# EAGLE design crz7shlda0 (EAGLE 9.6.2)

## Sheet 1 of 2
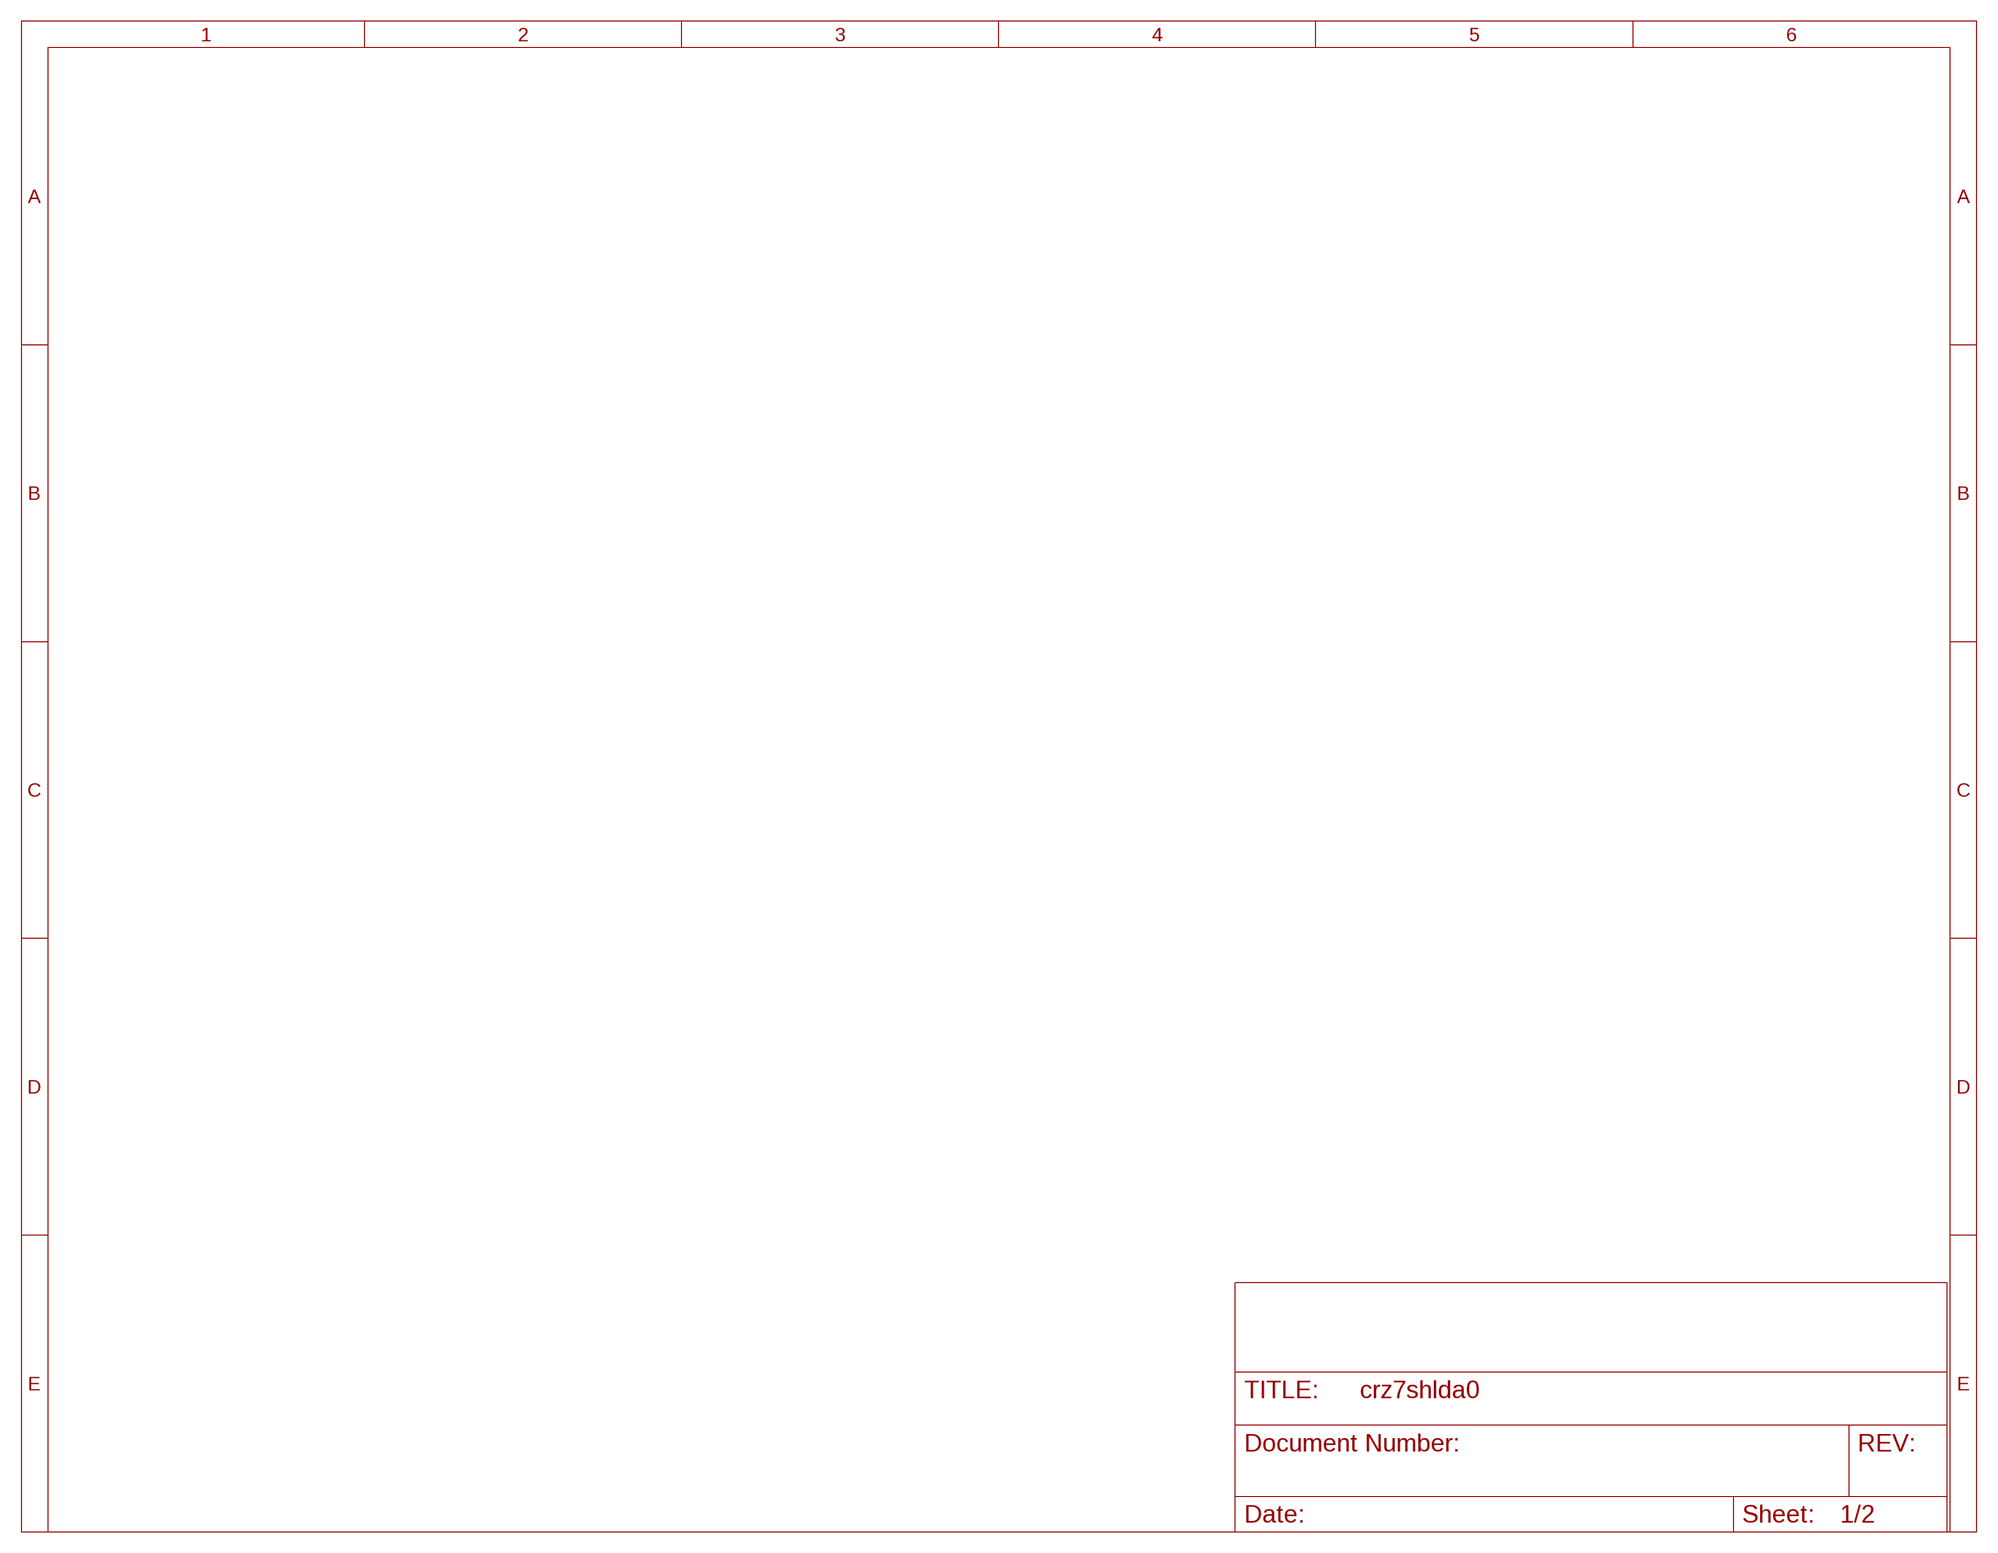
[diagram p0: schematic, sheet 1]

## Sheet 2 of 2
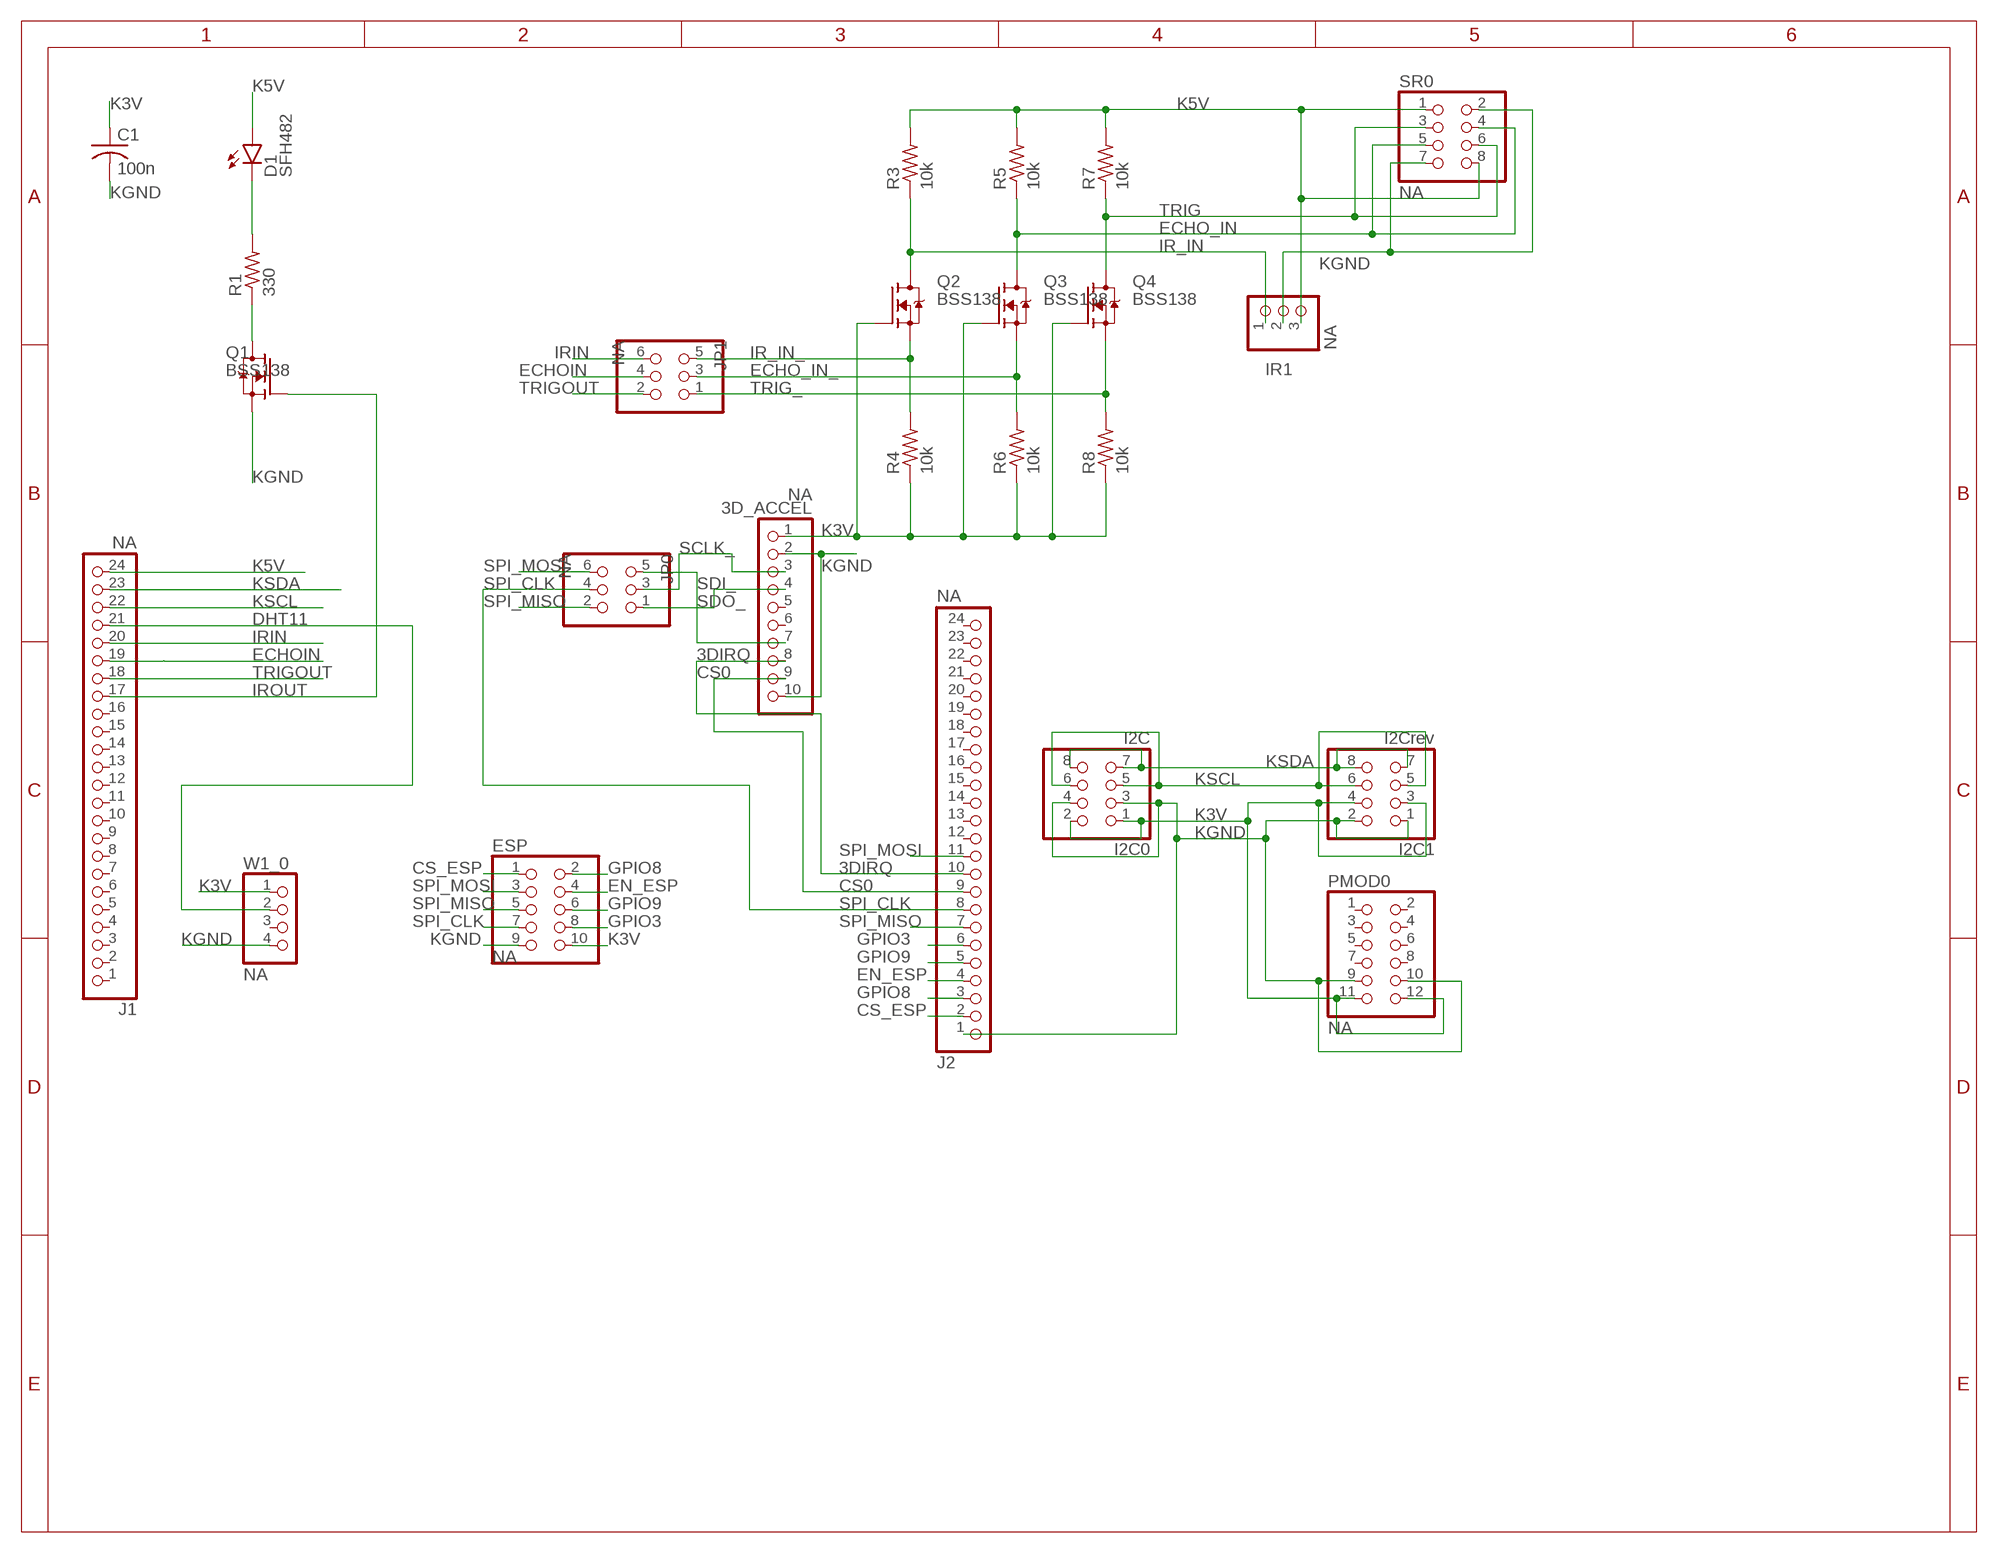
[diagram p1: schematic, sheet 2]

### Parts
3D_ACCEL  NA  PINHD-1X10  [1X10]
C1  100n  C-USC0402  [C0402]
D1  SFH482  [SFH482]
ESP  NA  PINHD-2X5  [2X05]
I2C0  I2C  PINHD-2X4  [2X04]
I2C1  I2Crev  PINHD-2X4  [2X04]
IR1  NA  PINHD-1X3  [1X03]
J1  NA  PINHD-1X24  [1X24]
J2  NA  PINHD-1X24  [1X24]
JP0  NA  PINHD-2X3  [2X03]
JP1  NA  PINHD-2X3  [2X03]
PMOD0  NA  PINHD-2X6  [2X06]
Q1  BSS138  [SOT23]
Q2  BSS138  [SOT23]
Q3  BSS138  [SOT23]
Q4  BSS138  [SOT23]
R1  330  R-US_R0402  [R0402]
R3  10k  R-US_R0402  [R0402]
R4  10k  R-US_R0402  [R0402]
R5  10k  R-US_R0402  [R0402]
R6  10k  R-US_R0402  [R0402]
R7  10k  R-US_R0402  [R0402]
R8  10k  R-US_R0402  [R0402]
SR0  NA  PINHD-2X4  [2X04]
W1_0  NA  PINHD-1X4  [1X04]

### Nets
3DIRQ: 3D_ACCEL.8 J2.10
CS0: 3D_ACCEL.9 J2.9
CS_ESP: ESP.1 J2.2
DHT11: J1.21 W1_0.2
ECHO_IN: Q3.3(D) R5.1 SR0.4 SR0.5
ECHO_IN_: JP1.3 Q3.2(S) R6.2
ECHOIN: J1.19 JP1.4
EN_ESP: ESP.4 J2.4
GPIO3: ESP.8 J2.6
GPIO8: ESP.2 J2.3
GPIO9: ESP.6 J2.5
IR_IN: IR1.1 Q2.3(D) R3.1
IR_IN_: JP1.5 Q2.2(S) R4.2
IRIN: J1.20 JP1.6
IROUT: J1.17 Q1.1(G)
K3V: 3D_ACCEL.1 C1.1 ESP.10 I2C0.1 I2C0.2 I2C1.3 I2C1.4 PMOD0.11 PMOD0.12 Q2.1(G) Q3.1(G) Q4.1(G) R4.1 R6.1 R8.1 W1_0.1
K5V: D1.A IR1.3 J1.24 R3.2 R5.2 R7.2 SR0.1 SR0.8
KGND: 3D_ACCEL.2 3D_ACCEL.10 C1.2 ESP.9 I2C0.3 I2C0.4 I2C1.1 I2C1.2 IR1.2 J2.1 PMOD0.9 PMOD0.10 Q1.2(S) SR0.2 SR0.7 W1_0.4
KSCL: I2C0.5 I2C0.6 I2C1.5 I2C1.6 J1.22
KSDA: I2C0.7 I2C0.8 I2C1.7 I2C1.8 J1.23
N$3: Q1.3(D) R1.1
N$5: D1.K(C) R1.2
SCLK_: 3D_ACCEL.3 JP0.3
SDI_: 3D_ACCEL.4 JP0.1
SDO_: 3D_ACCEL.7 JP0.5
SPI_CLK: ESP.7 J2.8 JP0.4
SPI_MISO: ESP.5 J2.7 JP0.2
SPI_MOSI: ESP.3 J2.11 JP0.6
TRIG: Q4.3(D) R7.1 SR0.3 SR0.6
TRIG_: JP1.1 Q4.2(S) R8.2
TRIGOUT: J1.18 JP1.2
Unconnected: 3D_ACCEL.5 3D_ACCEL.6 J1.1 J1.2 J1.3 J1.4 J1.5 J1.6 J1.7 J1.8 J1.9 J1.10 J1.11 J1.12 J1.13 J1.14 J1.15 J1.16 J2.12 J2.13 J2.14 J2.15 J2.16 J2.17 J2.18 J2.19 J2.20 J2.21 J2.22 J2.23 J2.24 PMOD0.1 PMOD0.2 PMOD0.3 PMOD0.4 PMOD0.5 PMOD0.6 PMOD0.7 PMOD0.8 W1_0.3

## Library data of the parts
3D_ACCEL = pinhead2:PINHD-1X10: PIN HEADER
C1 = rcl:C-US: CAPACITOR, American symbol; SPICEPREFIX: C
D1 = led:SFH482: IR LED infrared emitting diode, Infineon
ESP = pinhead:PINHD-2X5: PIN HEADER
I2C0 I2C1 SR0 = pinhead:PINHD-2X4: PIN HEADER
IR1 = pinhead2:PINHD-1X3: PIN HEADER
J1 J2 = pinhead2:PINHD-1X24: PIN HEADER
JP0 JP1 = pinhead:PINHD-2X3: PIN HEADER
PMOD0 = pinhead:PINHD-2X6: PIN HEADER
Q1-Q4 = bss138_10:BSS138: BSS138 N-Channel Logic Level Enhancement Mode Field Effect Transistor Source: http://www.fairchildsemi.com/datasheets/BS/BSS138.pdf; MF: Fairchild; MPN: BSS138; OC_FARNELL: 9845330; OC_NEWARK: 67R2009
R1 R3-R8 = rcl:R-US_: RESISTOR, American symbol; SPICEPREFIX: R
W1_0 = pinhead2:PINHD-1X4: PIN HEADER

## Board
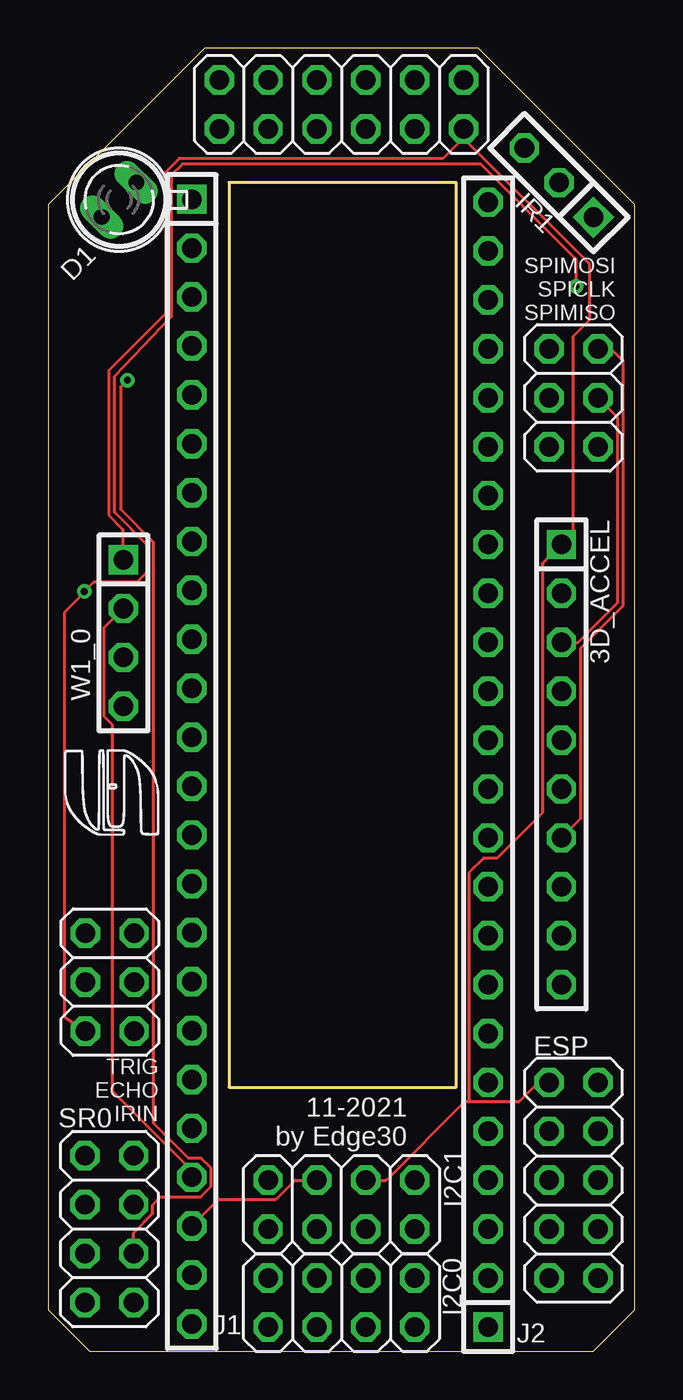
[diagram p2: board, top side]
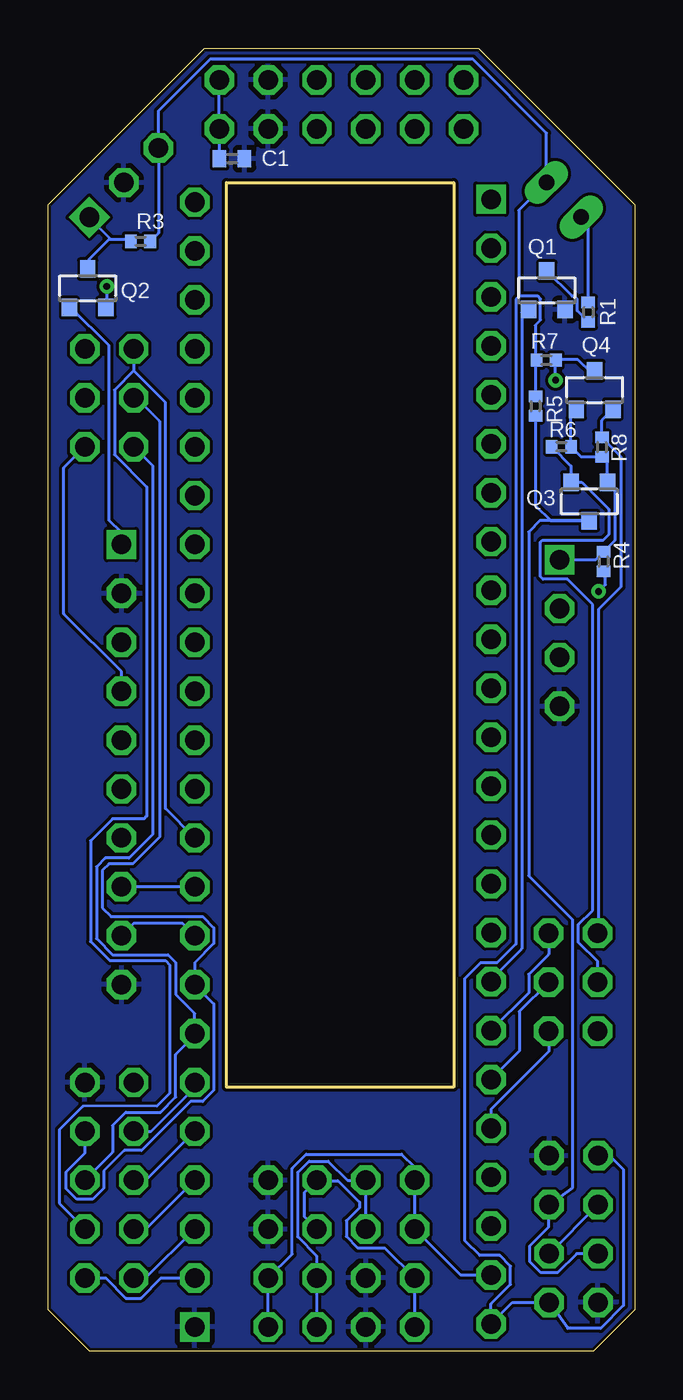
[diagram p3: board, bottom side, seen from below]

Size 30.48 x 67.69 mm. Coordinates in mm from the lower left corner, seen from the top.
Outline: 0,59.56 0,2.16 2.16,0 28.32,0 30.48,2.16 30.48,59.56 22.35,67.69 8.13,67.69 0,59.56
Outline: 9.4,13.72 21.21,13.72 21.21,60.71 9.4,60.71 9.4,13.72
Copper layers (1*16): Top 0.035mm / dielectric 0.15mm / Bottom 0.035mm
Design rules "default *": minimum track width 6mil, minimum drill 0.35mm, track to track 6mil, track to pad 6mil, pad to pad 6mil, via to via 6mil, smd to smd 6mil, copper to edge 6mil, drill to drill 6mil, minimum pad ring 10mil, minimum via ring 8mil, stop-mask expansion 4mil, vias tented up to drill 0mil, thermal gap 10mil
Milling: area 9.4,13.7 to 21.2,60.7

### Footprints (pad centres in the part's own frame; a part is rotated, then mirrored left to right if it is on the bottom)
1X10 = drill 1.016 square: 1 -11.43,0 | drill 1.016 octagon: 2 -8.89,0; 3 -6.35,0; 4 -3.81,0; 5 -1.27,0; 6 1.27,0; 7 3.81,0; 8 6.35,0; 9 8.89,0; 10 11.43,0
C0402 = smd 0.7 x 0.9: 1 -0.65,0; 2 0.65,0
SFH482 = drill 0.813 long: A -1.27,0; K 1.27,0
2X05 = drill 1.016 octagon: 1 -5.08,-1.27; 2 -5.08,1.27; 3 -2.54,-1.27; 4 -2.54,1.27; 5 0,-1.27; 6 0,1.27; 7 2.54,-1.27; 8 2.54,1.27; 9 5.08,-1.27; 10 5.08,1.27
2X04 = drill 1.016 octagon: 1 -3.81,-1.27; 2 -3.81,1.27; 3 -1.27,-1.27; 4 -1.27,1.27; 5 1.27,-1.27; 6 1.27,1.27; 7 3.81,-1.27; 8 3.81,1.27
1X03 = drill 1.016 square: 1 -2.54,0 | drill 1.016 octagon: 2 0,0; 3 2.54,0
1X24 = drill 1.016 square: 1 -29.21,0 | drill 1.016 octagon: 2 -26.67,0; 3 -24.13,0; 4 -21.59,0; 5 -19.05,0; 6 -16.51,0; 7 -13.97,0; 8 -11.43,0; 9 -8.89,0; 10 -6.35,0; 11 -3.81,0; 12 -1.27,0; 13 1.27,0; 14 3.81,0; 15 6.35,0; 16 8.89,0; 17 11.43,0; 18 13.97,0; 19 16.51,0; 20 19.05,0; 21 21.59,0; 22 24.13,0; 23 26.67,0; 24 29.21,0
2X03 = drill 1.016 octagon: 1 -2.54,-1.27; 2 -2.54,1.27; 3 0,-1.27; 4 0,1.27; 5 2.54,-1.27; 6 2.54,1.27
2X06 = drill 1.016 octagon: 1 -6.35,-1.27; 2 -6.35,1.27; 3 -3.81,-1.27; 4 -3.81,1.27; 5 -1.27,-1.27; 6 -1.27,1.27; 7 1.27,-1.27; 8 1.27,1.27; 9 3.81,-1.27; 10 3.81,1.27; 11 6.35,-1.27; 12 6.35,1.27
SOT23 = smd 0.8 x 0.9: 1 -0.95,-1; 2 0.95,-1; 3 0,1
R0402 = smd 0.6 x 0.7: 1 -0.5,0; 2 0.5,0
1X04 = drill 1.016 square: 1 -3.81,0 | drill 1.016 octagon: 2 -1.27,0; 3 1.27,0; 4 3.81,0

### Placement (x,y rotation side)
3D_ACCEL  26.67,30.48 270 top
C1  20.93,61.95 0 bottom
D1  3.68,59.82 225 top
ESP  27.3,8.89 90 top
I2C0  15.24,2.54 0 top
I2C1  15.24,7.62 180 top
IR1  26.54,60.71 135 top
J1  7.47,30.63 270 top
J2  22.86,30.48 90 top
JP0  27.3,49.53 90 top
JP1  3.2,19.18 270 top
PMOD0  15.24,64.77 0 top
Q1  4.57,55.12 0 bottom
Q2  28.42,55.22 0 bottom
Q3  2.36,44.15 180 bottom
Q4  2.08,49.94 0 bottom
R1  2.41,53.98 90 bottom
R3  25.68,57.66 0 bottom
R4  1.63,41.02 270 bottom
R5  5.16,49.1 90 bottom
R6  3.81,46.99 180 bottom
R7  4.6,51.49 180 bottom
R8  1.7,46.96 90 bottom
SR0  3.17,6.35 270 top
W1_0  3.91,37.31 270 top

### Tracks (layer width: path | path; a pad name or v marks a point on that pad's centre or on a via)
3DIRQ
  Bottom 0.152: J2.10 3D_ACCEL.8
CS0
  Bottom 0.152: J2.9 23.52,22.25 26.01,22.25 3D_ACCEL.9
CS_ESP
  Bottom 0.152: ESP.1 27.49,3.81 26.45,2.77 25.65,2.77 24.61,3.81 J2.2
DHT11
  Top 0.152: W1_0.2 2.92,37.59 2.92,32.97 3.35,32.54 3.35,13.51 7.47,9.4 J1.21
ECHO_IN
  Bottom 0.152: SR0.5 3.02,5.08 4.01,4.09 4.88,4.09 5.44,4.64 5.44,5.49 4.46,6.46 SR0.4 3.25,8.48 3.25,22.44 5.51,24.7 5.51,42.56 4.93,43.15 Q3.3 4.36,43.15 5.16,43.94 R5.1
ECHO_IN_
  Bottom 0.152: JP1.3 1.93,20.24 2.93,21.24 2.93,22.17 2.18,22.91 2.18,38.79 3.5,40.11 4.77,40.11 4.9,40.24 4.9,42.03 4.8,42.14 1.64,42.14 1.35,42.42 1.35,43.74 2.76,45.15 Q3.2 3.31,45.99 R6.2
ECHOIN
  Bottom 0.152: JP1.4 5.99,17.65 5.99,15.6 J1.19
EN_ESP
  Bottom 0.152: ESP.4 25.4,6.35 J2.4
GPIO3
  Bottom 0.152: ESP.8 25.12,11.43 22.86,13.69 J2.6
GPIO8
  Bottom 0.152: ESP.2 25.4,3.81 J2.3
GPIO9
  Bottom 0.152: ESP.6 25.4,8.89 J2.5
IR_IN
  Bottom 0.152: 27.23,57.76 27.3,57.76 28.35,56.72 28.35,56.24 Q2.3 | 27.23,57.76 26.21,57.76 R3.1 | IR1.1 28.34,58.87 27.23,57.76
IR_IN_  (via drill 0.35)
  Top 0.152: JP1.5 0.86,17.35 0.86,38.41 1.88,39.42 v1.88,39.47 2.39,39.98 4.65,39.98 5.16,40.49 5.16,41.88 3.45,43.59 3.45,50.65 6.43,53.76 6.43,61.11 6.99,61.67 22.48,61.67 27.43,56.72 v27.43,55.32
  Bottom 0.152: v1.88,39.47 1.52,39.83 1.52,40.25 R4.2 | v27.43,55.32 27.43,54.25 Q2.2
IRIN
  Bottom 0.152: JP1.6 4.47,15.57 7.47,12.57 J1.20
IROUT
  Bottom 0.152: J1.17 7.47,19.3 5.87,20.91 5.87,53.98 5.72,54.12 Q1.1
K3V
  Top 0.152: W1_0.1 3.91,42.67 3.15,43.43 3.15,50.94 6.1,53.89 6.1,61.24 6.83,61.98 20.55,61.98 21.59,63.02 | 21.87,12.95 21.87,24.87 22.61,25.6 23.32,25.6 25.68,27.96 25.68,40.92 3D_ACCEL.1 27.25,42.49 27.25,52.7 28.14,53.59 28.14,56.46 21.59,63.02 | I2C1.3 17.58,8.89 21.64,12.95 21.87,12.95 | ESP.10 25.45,13.97 25.45,13.95 24.46,12.95 21.87,12.95 | 21.59,63.02 PMOD0.11
  Bottom 0.152: Q4.1 3.05,48.92 3.31,48.66 R6.1 2.8,46.48 1.71,46.48 R8.1 1.41,46.17 Q3.1 1.02,44.75 1.02,42.13 R4.1 2.02,41.12 W1_0.1 | Q2.1 29.3,54.22 27.33,52.25 27.33,43.18 26.67,42.52 3D_ACCEL.1 | I2C0.1 I2C0.2 12.98,5.36 14.38,5.36 14.99,5.96 14.99,6.78 14.3,7.47 14.3,7.75 15.42,8.87 16.48,8.87 I2C1.3 17.17,8.23 17.17,7.01 I2C1.4 | C1.1 PMOD0.11 PMOD0.12
K5V
  Bottom 0.152: R3.2 24.75,58.09 IR1.3 24.75,64.43 22.05,67.13 8.43,67.13 4.58,63.28 D1.A 6.02,59.27 6.02,54.79 | 6.02,54.79 6.02,54.8 5.03,54.8 4.89,54.66 4.89,53.57 5.17,53.29 5.17,51.56 R7.2 5.16,51.43 R5.2 | 6.02,54.79 6.17,54.64 6.17,21.16 7.14,20.19 8,20.19 8.81,19.38 8.81,5.74 8.05,4.98 7.01,4.98 6.45,4.42 6.45,3.48 7.47,2.46 J1.24 6.35,2.54 SR0.8 3.48,1.19 1.77,1.19 0.58,2.38 0.58,9.45 1.29,10.16 SR0.1
KGND
  pour Bottom (isolate 0.152): 30.48,59.56 30.48,2.16 28.32,0 2.16,0 0,2.16 0,59.56 8.13,67.69 22.35,67.69
KSCL
  Top 0.152: I2C1.5 12.83,8.89 11.84,7.9 8.87,7.9 J1.22
  Bottom 0.152: I2C1.6 I2C1.5 14.94,8.89 15.93,9.88 16.92,9.88 17.5,9.3 17.5,5.94 16.51,4.95 I2C0.6 I2C0.5
KSDA
  Bottom 0.152: I2C0.7 I2C0.8 17.8,5.05 17.8,9.5 17.07,10.24 12.11,10.24 11.43,9.55 I2C1.7 I2C1.8 9.04,3.96 J1.23
N$3
  Bottom 0.152: R1.1 2.99,54.05 2.99,54.66 3.13,54.8 3.25,54.8 Q1.3
N$5
  Bottom 0.152: R1.2 2.41,58.55 D1.K
SCLK_
  Top 0.152: 3D_ACCEL.3 27.53,36.83 29.57,38.86 29.57,48.54 JP0.3
SDI_
  Bottom 0.152: 3D_ACCEL.4 26.67,35.31 29.67,38.3 29.67,45.9 JP0.1
SDO_
  Top 0.152: JP0.5 29.26,52.07 29.87,51.46 29.87,38.71 27.69,36.52 27.69,27.69 3D_ACCEL.7
SPI_CLK
  Bottom 0.152: JP0.4 25.91,49.53 24.69,48.31 24.69,26.72 26.08,25.32 27.31,25.32 27.66,24.97 27.66,23.03 27.21,22.58 22.45,22.58 21.87,22 21.87,21.18 22.86,20.19 J2.8 21.87,18.06 21.87,13.56 22.45,12.98 23.09,12.98 25.62,10.44 26.52,10.44 27.58,9.38 27.58,8.48 28.16,7.9 28.98,7.9 29.57,8.48 29.57,9.3 28.57,10.29 ESP.7
SPI_MISO
  Bottom 0.152: ESP.5 27.13,10.34 27.13,11.74 26.45,12.42 24.64,12.42 23.85,13.21 23.85,15.42 22.86,16.41 J2.7 22.86,17.55 23.85,18.54 23.85,20.19 24.26,20.6 27.13,20.6 27.96,21.44 27.96,25.17 27.51,25.63 26.28,25.63 25.04,26.86 25.04,46 JP0.2
SPI_MOSI
  Bottom 0.152: 26.04,50.93 27.03,49.94 27.03,46.58 25.35,44.9 25.35,27.8 25.49,27.66 27.13,27.66 28.27,26.52 28.27,21.29 27.28,20.3 24.38,20.3 24.16,20.07 24.16,13.41 24.82,12.75 28.68,12.72 29.9,11.51 29.9,7.69 28.57,6.37 ESP.3 | J2.11 24.38,28.19 24.38,49.28 26.04,50.93 | JP0.6 26.04,50.93
TRIG  (via drill 0.35)
  Top 0.152: v4.12,50.44 3.76,50.09 3.76,43.74 5.49,42.01 5.49,11.84 7.29,10.03 7.95,10.03 8.46,9.53 8.46,8.56 7.92,8.03 5.84,8.03 5.44,7.62 5.44,7.16 4.45,6.17 SR0.6
  Bottom 0.152: Q4.3 2.13,50.9 2.23,50.8 2.95,51.51 3.96,51.51 R7.1 4.12,51.36 v4.12,50.44 | SR0.6 SR0.3
TRIG_
  Bottom 0.152: Q4.2 1.7,48.37 R8.2 0.71,46.47 0.71,39.7 1.88,38.53 1.88,21.77 JP1.1
TRIGOUT
  Bottom 0.152: JP1.2 4.47,20.62 5.51,19.58 5.51,18.62 J1.18

### Text on the board
tPlace: SPIMOSI / SPICLK / SPIMISO | TRIG / ECHO / IRIN | 11-2021 / by Edge30